# Altium schematic sheet microcontroller.SchDoc
size A4; SheetNumber: 3; SheetTotal: 5
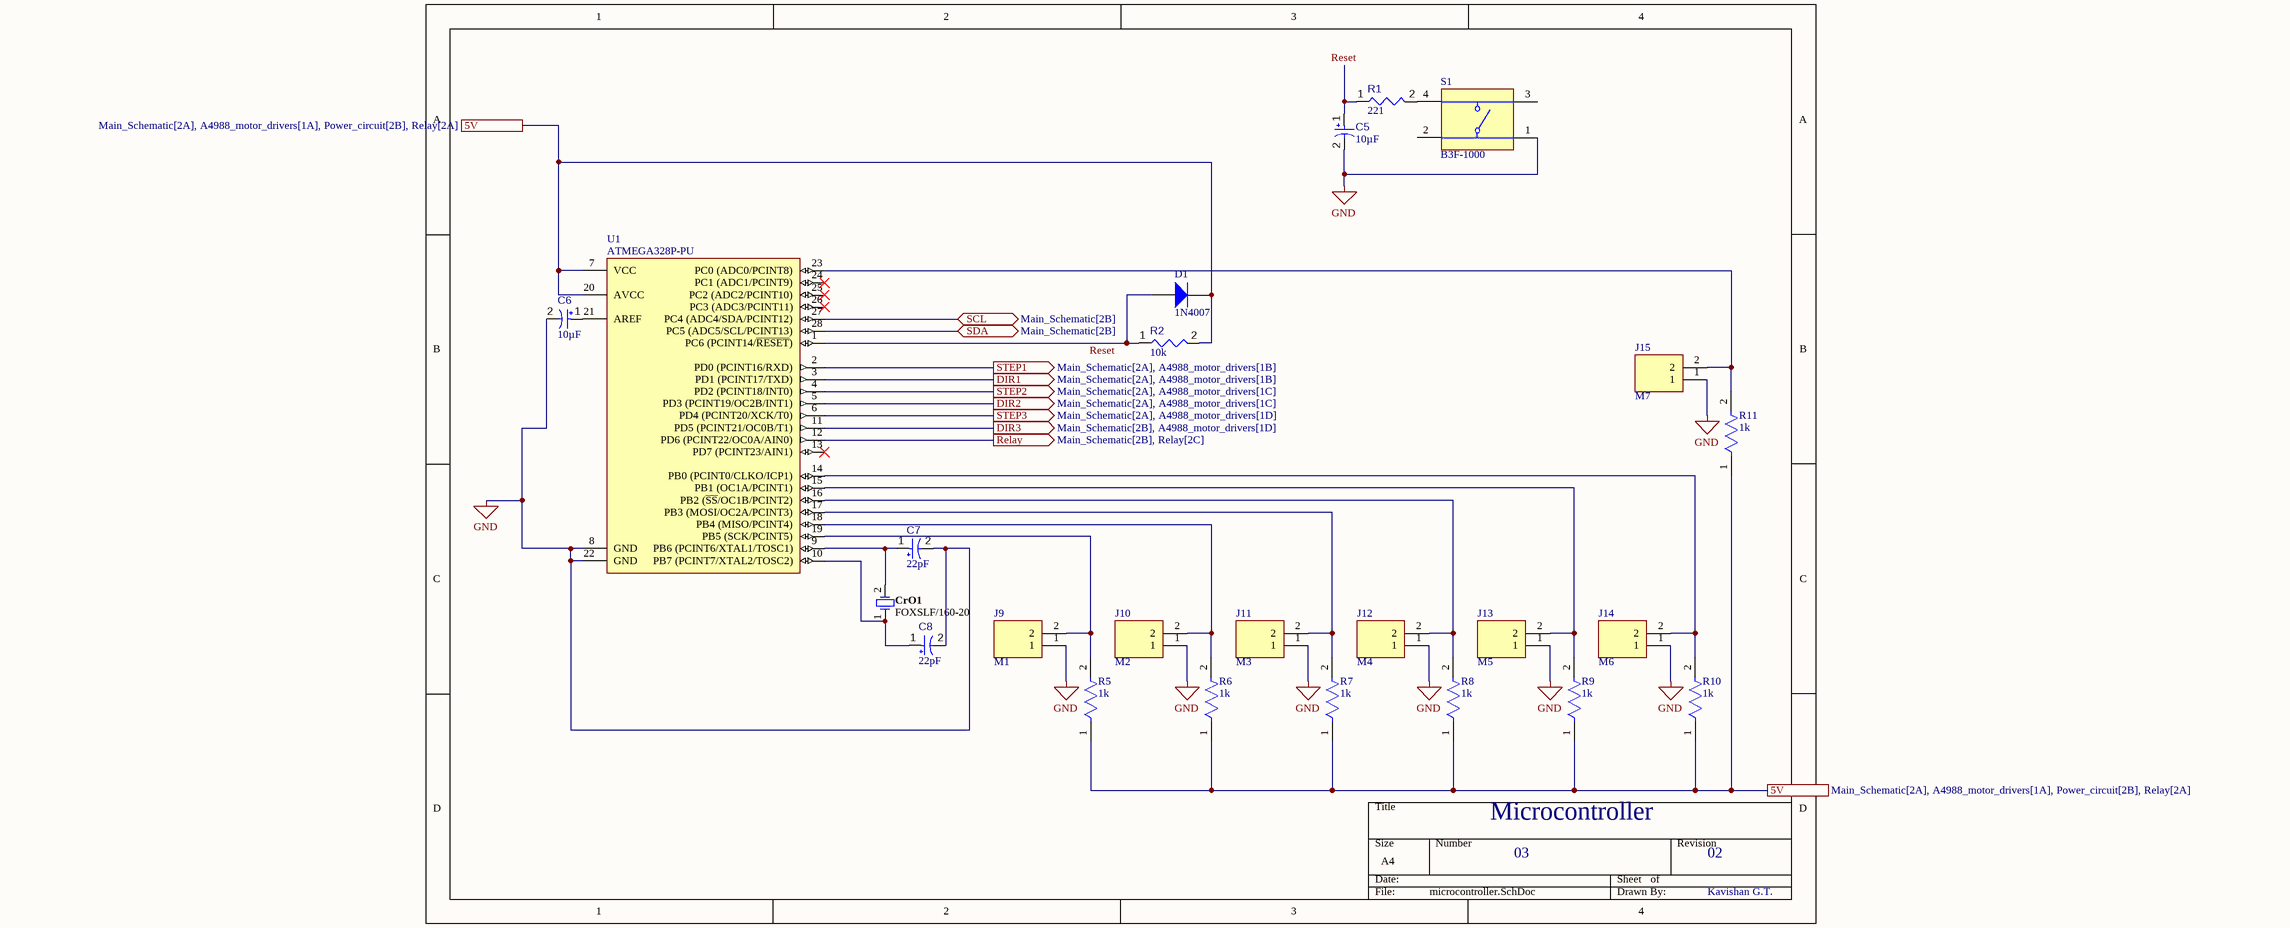
[diagram p0: microcontroller.SchDoc]

## Parts
C5  value 10µF  [CAPPR55-200-1100X500X1200]  (hidden comment: ECA1HM100)
C6  value 10µF  [CAPPR55-200-1100X500X1200]  (hidden comment: ECA1HM100)
C7  value 22pF  [CAPPR55-200-1100X500X1200]  (hidden comment: ECA1HM100)
C8  value 22pF  [CAPPR55-200-1100X500X1200]  (hidden comment: ECA1HM100)
CrO1  FOXSLF/160-20  [FOX-FOXSLF160-20]
D1  1N4007  [FAIR-DO-41-2]
J9  M1  [SHDR2W64P0X250_1X2_750X380X600P]
J10  M2  [SHDR2W64P0X250_1X2_750X380X600P]
J11  M3  [SHDR2W64P0X250_1X2_750X380X600P]
J12  M4  [SHDR2W64P0X250_1X2_750X380X600P]
J13  M5  [SHDR2W64P0X250_1X2_750X380X600P]
J14  M6  [SHDR2W64P0X250_1X2_750X380X600P]
J15  M7  [SHDR2W64P0X250_1X2_750X380X600P]
R1  value 221  [RESA60-630X240]  (hidden comment: MFR-25FBF52-221R)
R2  value 10k  [RESA60-630X240]  (hidden comment: MFR-25FBF52-10K)
R5  1k  [FP-MFR-25-MFG]
R6  1k  [FP-MFR-25-MFG]
R7  1k  [FP-MFR-25-MFG]
R8  1k  [FP-MFR-25-MFG]
R9  1k  [FP-MFR-25-MFG]
R10  1k  [FP-MFR-25-MFG]
R11  1k  [FP-MFR-25-MFG]
S1  B3F-1000  [OMRON-B3F-1000-4_V]
U1  ATMEGA328P-PU  [ATML-28P3]

## Ports
5V (see Main_Schematic[2A], A4988_motor_drivers[1A], Power_circuit[2B], Relay[2A]), DIR1 (out, see Main_Schematic[2A], A4988_motor_drivers[1B]), DIR2 (out, see Main_Schematic[2A], A4988_motor_drivers[1C]), DIR3 (out, see Main_Schematic[2B], A4988_motor_drivers[1D]), Relay (out, see Main_Schematic[2B], Relay[2C]), SCL (bidir, see Main_Schematic[2B]), SDA (bidir, see Main_Schematic[2B]), STEP1 (out, see Main_Schematic[2A], A4988_motor_drivers[1B]), STEP2 (out, see Main_Schematic[2A], A4988_motor_drivers[1C]), STEP3 (out, see Main_Schematic[2A], A4988_motor_drivers[1D])

## Nets
GND: C5.2 C6.2 C7.2 C8.2 J9.1 J10.1 J11.1 J12.1 J13.1 J14.1 J15.1 S1.1 U1.8(GND) U1.22(GND)
5V: D1.1(K) R2.2 R5.1 R6.1 R7.1 R8.1 R9.1 R10.1 R11.1 U1.7(VCC) U1.20(AVCC) ; port 5V
DIR1: U1.3(PD1_(PCINT17/TXD)) ; port DIR1
DIR2: U1.5(PD3_(PCINT19/OC2B/INT1)) ; port DIR2
DIR3: U1.11(PD5_(PCINT21/OC0B/T1)) ; port DIR3
Relay: U1.12(PD6_(PCINT22/OC0A/AIN0)) ; port Relay
Reset: C5.1 D1.2(A) R1.1 R2.1 U1.1(PC6_(PCINT14/~{RESET}))
SCL: U1.27(PC4_(ADC4/SDA/PCINT12)) ; port SCL
SDA: U1.28(PC5_(ADC5/SCL/PCINT13)) ; port SDA
STEP1: U1.2(PD0_(PCINT16/RXD)) ; port STEP1
STEP2: U1.4(PD2_(PCINT18/INT0)) ; port STEP2
STEP3: U1.6(PD4_(PCINT20/XCK/T0)) ; port STEP3
NetC6_1: C6.1 U1.21(AREF)
NetC7_1: C7.1 CrO1.2 U1.9(PB6_(PCINT6/XTAL1/TOSC1))
NetC8_1: C8.1 CrO1.1 U1.10(PB7_(PCINT7/XTAL2/TOSC2))
NetJ9_2: J9.2 R5.2 U1.19(PB5_(SCK/PCINT5))
NetJ10_2: J10.2 R6.2 U1.18(PB4_(MISO/PCINT4))
NetJ11_2: J11.2 R7.2 U1.17(PB3_(MOSI/OC2A/PCINT3))
NetJ12_2: J12.2 R8.2 U1.16(PB2_(~{SS}/OC1B/PCINT2))
NetJ13_2: J13.2 R9.2 U1.15(PB1_(OC1A/PCINT1))
NetJ14_2: J14.2 R10.2 U1.14(PB0_(PCINT0/CLKO/ICP1))
NetJ15_2: J15.2 R11.2 U1.23(PC0_(ADC0/PCINT8))
NetR1_2: R1.2 S1.4

Not connected (* = marked no-connect by the designer): S1 2 3; U1 13(PD7_(PCINT23/AIN1))* 24(PC1_(ADC1/PCINT9))* 25(PC2_(ADC2/PCINT10))* 26(PC3_(ADC3/PCINT11))*

## Notes on the sheet
- Microcontroller
- 03
- 02
- Kavishan G.T.

## Library data of the parts
C5-C8 = CMP-001-00025-7: Aluminum Electrolytic Capacitor, 10 uF, +/- 20%, 50 V, -40 to 85 degC, 2-Pin THD, RoHS, Bulk; Manufacturer: Panasonic; Ripple Current (AC): 65mA; Voltage Rating: 50V; Mounting Technology: TH; RoHS Compliant: True; Capacitor Type: Electrolytic; Datasheet Version: Rev. 05, 10/2016; Min Operating Temperature: -40°C; Packaging: Bulk; Ripple Current: 65mA; Tolerance: 20%; Max Operating Temperature: 85°C; Datasheet URL: https://industrial.panasonic.com/cdbs/www-data/pdf/RDF0000/ABA0000C1218.pdf; Lead Pitch: 2mm; Pins: 2; Diameter: 5mm; Manufacturer URL: http://www.panasonic.com/; Package Reference: CAPPR55-200-1100X500X1200; Package Description: 2-Pin Radial Lead, Dia 5 mm, Height 12 mm; Case/Package: Radial; Package Quantity: 200
CrO1 = CMP-1749-00003-1: Resistance Weld Thru-Hole Crystal, 16 MHz, -20 to 70 degC, 2-Pin THD, RoHS, Bulk; Voltage Rating: 250 V; Tolerance: 1%; Resistance: 221 kohm; Case\Package: Axial; Power Rating: 250 mW; RoHSCompliant: true; Package Quantity: 200; Packaging: Bulk; Min Operating Temperature: -55 degC; DatasheetVersion: Mar-15; ComponentLink1URL: http://www.foxonline.com/; Max Operating Temperature: 155 degC; PackageReference: FOXSLF160-20; Mount: Through Hole; PackageDescription: 2-Pin Through Hole Device, Body 11.35 x 4.65 mm; ComponentLink1Description: Manufacturer URL; ComponentLink2URL: http://www.foxonline.com/pdfs/hc49slf.pdf; ComponentLink2Description: Datasheet; Length: 0.248 inch
D1 = CMP-004-00007-2: General Purpose Rectifier, 1.1 V, 1.0 A, -55 to 175 degC, 2-Pin DO-41, RoHS, Tape and Reel; Manufacturer: Fairchild; Peak Reverse Current: 5uA; Max Surge Current: 30A; Elements: 1; Forward Voltage: 1.1V; Package Version: Rev. 2, 09/2008; Forward Current: 1A; Package Quantity: 5000; Packaging: TapeandReel; Package URL: http://www.fairchildsemi.com/dwg/DO/DO41A.pdf; Manufacturer URL: https://www.fairchildsemi.com/; Package Reference: DO-41-2; Pins: 2; Min Operating Temperature: -55°C; Datasheet Version: Rev. 1.1.0, 11/2014; Max Operating Temperature: 175°C; RoHS Compliant: True; Case/Package: DO-41-2; Mounting Technology: TH; Package Description: 2-Pin Axial Lead, Dia 2.375 mm, Body Length 4.63 mm; Datasheet URL: https://www.fairchildsemi.com/datasheets/1N/1N4007.pdf
J9-J15 = B2B-EH-A: Connector; Manufacturer_Name: JST (JAPAN SOLDERLESS TERMINALS); Datasheet Link: http://www.jst-mfg.com/product/pdf/eng/eEH.pdf; Height: 6mm; Manufacturer_Part_Number: B2B-EH-A
R1 = CMP-009-00051-4: Axial Resistor, 221 Ohm, +/- 1%, 250 mW, -55 to 155 degC, 2-Pin THD, RoHS, Bulk; Manufacturer: Yageo; Power: 250mW; Voltage Rating: 250V; Package Quantity: 200; Manufacturer URL: http://www.yageo.com/; Case/Package: Axial; Package Reference: MFR-25; RoHS Compliant: True; Mounting Technology: TH; Datasheet URL: http://www.yageo.com/documents/recent/Yageo%20LR_MFR_2013.pdf; Packaging: Bulk; Package Description: 2-Pin Axial Lead, Dia 2.4 mm, Body Length 6.3 mm; Max Operating Temperature: 155°C; Tolerance: 1%; Datasheet Version: Apr-13; Min Operating Temperature: -55°C
R2 = CMP-009-00047-4: Axial Resistor, 10 KOhm, +/- 1%, 0.25 W, -55 to 155 degC, 2-Pin THD, RoHS, Bulk; Manufacturer: Yageo; Power: 250mW; Voltage Rating: 250V; Manufacturer URL: http://www.yageo.com/; Datasheet URL: http://www.yageo.com/documents/recent/Yageo%20LR_MFR_2013.pdf; Package Reference: MFR-25; Min Operating Temperature: -55°C; Mounting Technology: TH; Package Quantity: 200; Case/Package: Axial; Tolerance: 1%; RoHS Compliant: True; Datasheet Version: Apr-13; Packaging: Bulk; Max Operating Temperature: 155°C; Package Description: 2-Pin Axial Lead, Dia 2.4 mm, Body Length 6.3 mm
R5-R11 = CMP-03413-000001-1: RES 1.18K OHM 1/4W 1% AXIAL; Manufacturer: Yageo; Manufacturer Part Number: MFR-25FBF52-1K18; Value: 1.18kΩ; Temperature Coefficient: 100ppm/°C; Power Rating: 0.25W; Voltage Rating: 250V; Temperature: -55°C to +155°C; Automotive: No; Temperature Range High: +155°C; Mouser Description: Metal Film Resistors 1.18K OHM 1/4W 1%; Digikey Description: RES 1.18K OHM 1/4W 1% AXIAL; Lead Free: Yes; Tolerance: 1%; ComponentLink2Description: Datasheet; ComponentLink2URL: https://www.yageo.com/upload/media/product/products/datasheet/lr/Yageo_LR_MFR_1.pdf; Temperature Range Low: -55°C; Package: MFR-25; Ipc Land Pattern Name: RESAD1000W75L680D260; Composition: Metal Film; Category: Res; Octopart: https://octopart.com/mfr-25fbf52-1k18-yageo-56251681; Series: MFR; Device Class L2: Resistors; Height: 2.6mm; Resistance: 1.18kΩ; Device Class L3: Through-Hole Resistors; RoHS: TRUE; Device Class L1: Passive Components
S1 = CMP-011-00004-2: Tactile Switch, SPST-NO, 0.05 A, 24 V, -25 to 70 degC, 4-Pin THD, RoHS, Bulk; Manufacturer: Omron Electronic Components; Throw Configuration: SPST; Max Contact Resistance: 100mohm; Resistance: 0.1Ohm; Max Current Rating: 50mA; Voltage Rating: 24V; Operating Force: 100gf; Datasheet Version: Jan-15; Case/Package: B3F-1000; Packaging: Bulk; Package Description: 4-Pin Through Hole Device, Body 6 x 6 mm; Manufacturer URL: http://www.omron.com/; Package Reference: B3F-1000; Contact Plating: Gold; Contact Current Rating: 50mA; RoHS Compliant: True; Contact Material: Gold; Mounting Technology: TH; Max Operating Temperature: 70°C; Min Operating Temperature: -25°C; Package Quantity: 1500; Datasheet URL: http://www.omron.com/ecb/products/pdf/en-b3f.pdf; Voltage Rating (DC): 24V; Pins: 4; Current Rating: 50mA; Max Voltage Rating (DC): 24V
U1 = CMP-020-00004-3: 8-Bit Microcontroller with 32 KBytes In-System Programmable Flash, 23 I/Os, -40 to 85 degC, 28-Pin PDIP (28P3), RoHS, Tube; Manufacturer: Atmel; I/Os: 23; Density: 32KB; Package Version: Rev. B, 09/2001; Max Clock Frequency: 20MHz; Interface: USART; Max Supply Voltage: 5.5V; Min Supply Voltage: 1.8V; Ethernet Channels: 0; RAM Size: 2KB; RoHS Compliant: True; Datasheet URL: http://www.atmel.com/images/Atmel-8271-8-bit-AVR-Microcontroller-ATmega48A-48PA-88A-88PA-168A-168PA-328-328P_datasheet_Complete.pdf; Packaging: Rail/Tube; Manufacturer URL: http://www.atmel.com/; Mounting Technology: TH; Package URL: http://www.atmel.com/images/Atmel-8271-8-bit-AVR-Microcontroller-ATmega48A-48PA-88A-88PA-168A-168PA-328-328P_datasheet_Complete.pdf; Datasheet Version: Rev. 8271J, 11/2015; Package Description: 28-Pin Plastic Dual Inline Package, Body 34.671 x 7.3025 mm, Pitch 2.54 mm; Package Quantity: 14; Min Operating Temperature: -40°C; Max Operating Temperature: 85°C; Case/Package: DIP; Pins: 28; Package Reference: 28P3